# Altium schematic sheet [CC2538] Power Circuit.SchDoc
size 254 x 208 mm
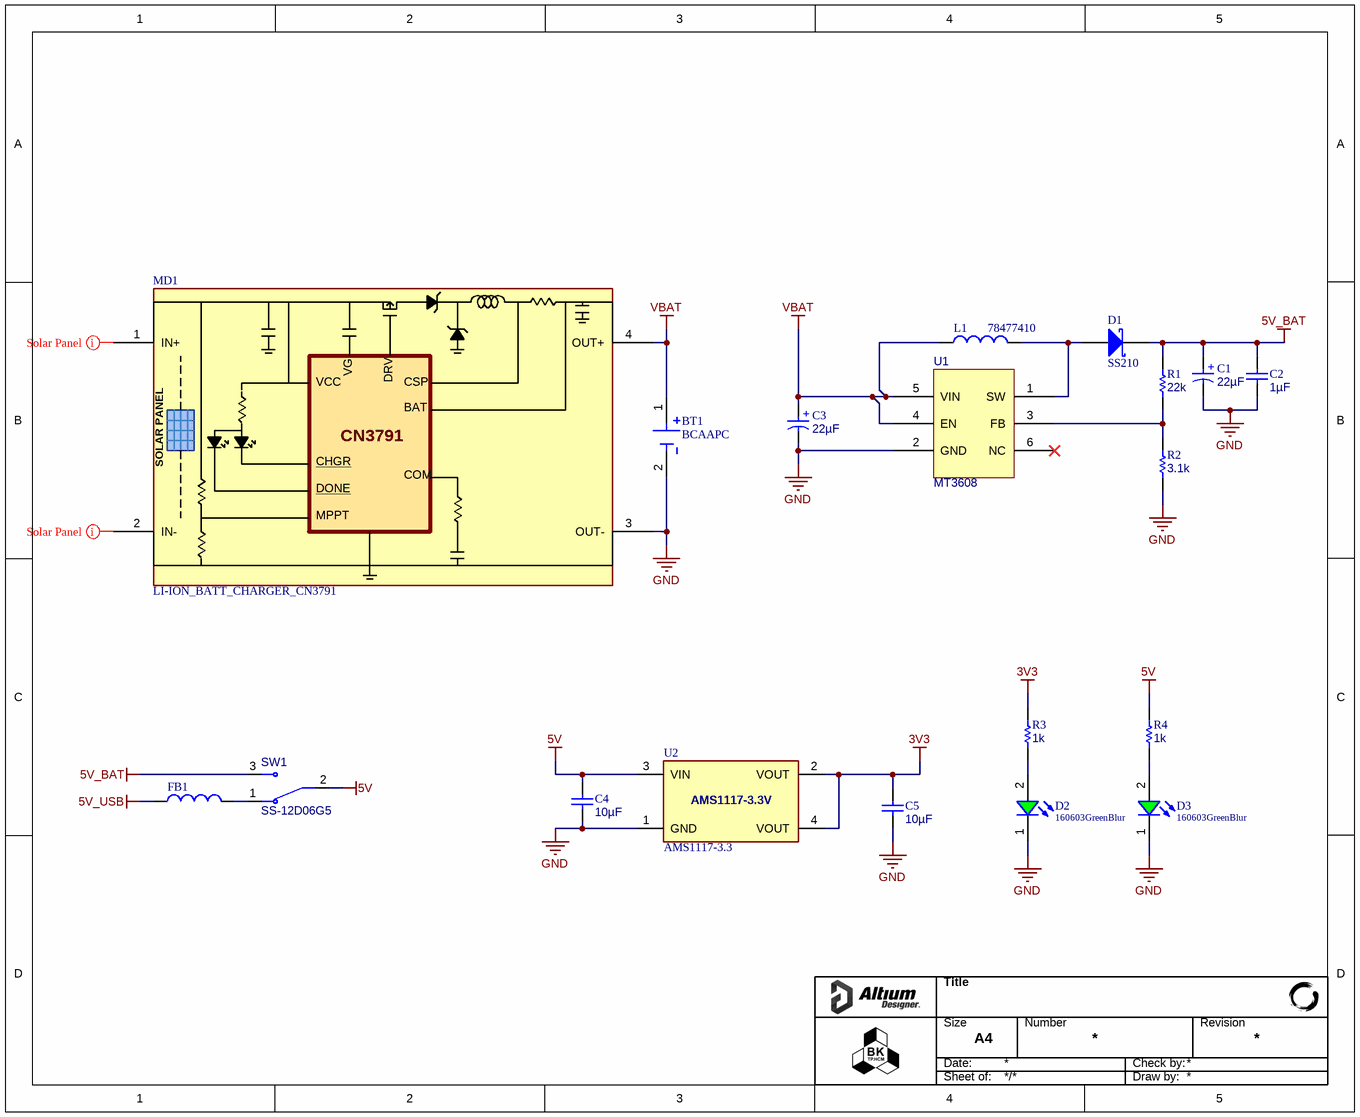
[diagram p0: [CC2538] Power Circuit.SchDoc]

## Parts
BT1  BCAAPC  [BCAAC]
C1  value 22µF  [WCAP-ASLI_D4H5.5]  (hidden comment: 865080340003)
C2  value 1µF  [CAP_0603]  (hidden comment: 0106031051016)
C3  value 22µF  [WCAP-ASLI_D4H5.5]  (hidden comment: 865080340003)
C4  value 10µF  [CAP_0603]  (hidden comment: 0106031061010)
C5  value 10µF  [CAP_0603]  (hidden comment: 0106031061010)
D1  SS210  [SS210-Footprint-SMA]
D2  160603GreenBlur  [WL-SMCW_0603_H=0.7mm]
D3  160603GreenBlur  [WL-SMCW_0603_H=0.7mm]
FB1  CBG160808U601T  [CBG160808U601T-Footprint]  (value not drawn)
L1  78477410  [WE-PD2A_4D28 (4730)]
MD1  LI-ION_BATT_CHARGER_CN3791  [LI-ION_BATT_CHARGER_CN3791-Footprint-1]
R1  value 22k  [RES_0603]  (hidden comment: 0006032231)
R2  value 3.1k  [RES_0603]  (hidden comment: 0006033121)
R3  value 1k  [RES_0603]  (hidden comment: 0006031021)
R4  value 1k  [RES_0603]  (hidden comment: 0006031021)
SW1  SS-12D06G5  [SS-12D06G5-Footprint]
U1  MT3608  [SOT95P280X145-6N]
U2  AMS1117-3.3  [FP-AMS1117-IPC_B]

## Nets
3V3: C5.2 R3.2 U2.2(VOUT) U2.4(VOUT)
5V: C4.2 R4.2 SW1.2 U2.3(VIN)
5V_BAT: C1.1(P) C2.2 D1.2(K) R1.2 SW1.3
5V_USB: FB1.1
GND: BT1.2(NEG) C1.2(N) C2.1 C3.2(N) C4.1 C5.1 D2.1(K) D3.1(K) MD1.3(OUT-) R2.1 U1.2(GND) U2.1(GND)
VBAT: BT1.1(POS) C3.1(P) L1.1 MD1.4(OUT+) U1.4(EN) U1.5(VIN)
NetD1_1: D1.1(A) L1.2 U1.1(SW)
NetD2_2: D2.2(A) R3.1
NetD3_2: D3.2(A) R4.1
NetFB1_2: FB1.2 SW1.1
NetR1_1: R1.1 R2.2 U1.3(FB)

Not connected (* = marked no-connect by the designer): MD1 1(IN+) 2(IN-); U1 6(NC)*

## Layout directives
mark named Solar Panel: NetMD1_1, NetMD1_2

## Notes on the sheet
- Inductor Selection
  The  recommended  values  of  inductor  are 4.7 to 22μH. Small size and better efficiency are the major concerns for portable device, such as MT3608 used for mobile phone. The inductor should have low core loss at 1.2MHz and low DCR for better efficiency. To avoid  inductor  saturation  current  rating  should  be  considered
- Diode Selection
  Schottky diode   is   a   good   choice   for   MT3608because  of  its  low  forward  voltage  drop  and  fast  reverses  recovery.  Using  Schottky  diode  can  get  better efficiency. The high speed rectification is also a  good  characteristic  of  Schottky  diode  for  high  switching frequency.
- (near U1) Capacitor Selection
  Input  and  output  ceramic  capacitors  of  22μF are recommended  for  MT3608  applications.
  The diode’ s reverse breakdown voltage should be larger than the output voltage
- (near R2) Output Voltage
  The  internal  reference VREF  is 0.6V (Typical).The output voltage is divided by a resistor divider,R1 and R2 to the FB pin. The output voltage is given by:
  VOUT=VREF(1+ROUT/RGND)
  Output Voltage: 5V
  VREF: 0.6V
- Title
- Size
- Date:
- A4
- Number
- Check by:
- Revision
- Sheet of:
- Draw by:
- (in symbol CMP-001-00129-2) +
- (in symbol CMP-019-00052-6) AMS1117-3.3V
- (in symbol CMP-00029-00007-6) VG; DRV; VCC; CSP; BAT; CN3791; SOLAR PANEL; CHGR; COM; DONE; MPPT

## Library data of the parts
BT1 = CMP-00029-00002-3: Battery Holder (Open) AA 1 Cell PC Pin; Supplier Locally Name: Thegioiic; Supplier Locally URL: https://www.thegioiic.com/hop-pin-1xaa-xuyen-lo-han-pcb
C1 C3 = CMP-001-00129-2: V-Chip, D4 x H5.5mm, 22uF, 16V; Manufacturer: Wurth Elektronik; Leakage Current: 3.52uA; Endurance: 2000h; Dissipation Factor: 16%; Capacitance Tolerance: +/-20%; Ripple Current: 90mA; Source: Al_Cap.SchLib; Supplier 1 URL: https://www.mouser.com/ProductDetail/Wurth-Elektronik/865080340003?qs=0KOYDY2FL2%252BowmC4S50IuQ%3D%3D; Supplier 2 URL: N/A; Supplier 3 SN: N/A; Pins: 2; Packaging: Tape and Reel; Manufacturer Part Number: N/A; Supplier 1 Name: Mouser; Operating Temperature Max: 105°C; Supplier 2 Name: Digi-Key; Supplier 2 SN: N/A; Design Item ID: 865080340003; Height: 5.5mm; Operating Temperature Min: -55°C; Component Type: Standard; Supplier 3 Name: thegioiic; Supplier 3 URL: https://www.thegioiic.com/tu-nhom-smd-22uf-16v-4x5-4mm; Category: Aluminum Electrolytic Capacitors; Rated Voltage (DC): 16V; Diameter: 4mm; Mount: Surface Mount; Supplier 1 SN: 710-865080340003
C2 = CMP-001-00177-2: CAP, size 0603, 1 uF, 16 VDC, 10%; Manufacturer Part Number: CL10B105KO8NNWC; Manufacturer: Samsung Electro-Mechanics; Voltage Rating DC: 16 VDC; Component Type: Standard; Supplier 3 URL: https://www.thegioiic.com/tu-gom-0603-1uf-16v; Operating Temperature Max: + 85 C; Tolerance: 10%; Supplier 3 Part Number: N/A; Source: Capacitor_0603_10_percent.SchLib; Case/Package: 0603; Supplier 1 Part Number: 187-CL10B105KO8NNWC; Operating Temperature Min: - 40 C; Packaging: Tape and Reel; Design Item ID: 0106031051016; LCSC Part #: C1592; Supplier 2 Part Number: 1276-CL10B105KO8NNWCTR-ND; Supplier 2 URL: https://www.digikey.com/en/products/detail/samsung-electro-mechanics/cl10b105ko8nnwc/16572783; Supplier 1 URL: https://www.mouser.vn/ProductDetail/Samsung-Electro-Mechanics/CL10B105KO8NNWC?qs=81r%252BiQLm7BT%252BXtc72qn1ug%3D%3D&utm_source=mouser-refine-download&utm_medium=file&utm_campaign=CL10B105KO8NNWC&utm_content=Samsung-Electro-Mechanics; ComponentLink1URL: https://www.mouser.vn/datasheet/2/585/Samsung_MLCC_1837944-1929650.pdf; Pins: 2; Mount: SMD/SMT; ComponentLink1Description: Datasheet
C4 C5 = CMP-001-00181-2: CAP, size 0603, 10 uF, 10 VDC, 10%; Manufacturer: Samsung Electro-Mechanics; Manufacturer Part Number: CL10A106KP8NNNC; Voltage Rating DC: 10 VDC; Supplier 2 Part Number: 1276-1192-2-ND; Pins: 2; Design Item ID: 0106031061010; Supplier 2 URL: https://www.digikey.com/en/products/detail/samsung-electro-mechanics/cl10a106kp8nnnc/3886850; Source: Capacitor_0603_10_percent.SchLib; Component Type: Standard; Operating Temperature Min: - 40 C; Packaging: Tape and Reel; Supplier 3 Part Number: N/A; Supplier 1 URL: https://www.mouser.vn/ProductDetail/Samsung-Electro-Mechanics/CL10A106KP8NNNC?qs=X6jEic%2FHinAlyfRHj7fKwg%3D%3D; LCSC Part #: C19702; Supplier 3 URL: https://www.thegioiic.com/tu-gom-0603-10uf-25v; ComponentLink1Description: Datasheet; Operating Temperature Max: + 85 C; ComponentLink1URL: https://www.mouser.vn/datasheet/2/585/MLCC-1837944.pdf; Mount: SMD/SMT; Case/Package: 0603; Supplier 1 Part Number: 187-CL10A106KP8NNNC; Tolerance: 10%
D1 = CMP-004-00056-1: Rectifier Diode, Schottky, 1 Phase, 1 Element, 1.5A, 100V V(RRM), Silicon, DO-214AA; Forward Voltage: 430mV; Max Operating Temperature: 150°C; Min Operating Temperature: -55°C; RoHS Compliant: Yes; Pins: 2
D2 D3 = CMP-004-00033-2: WL-SMCW SMT Mono-color Chip LED Blur, size 0603, Green, 3.2V, 140deg; ComponentLink1URL: N/A; ComponentLink4Description: Supplier 3 URL; Value: Green, 3.2V; ComponentLink2Description: Supplier 1 URL; Supplier 1 Name: Mouser; Supplier 1 SN: 755-SMLD12EN1WT86; Supplier 3 URL: N/A; Design Item ID: 160603GreenBlur; Supplier 3 Name: ICDayRoi; ComponentLink4URL: N/A; Color: Green; Pins: 2; Supplier 1 URL: https://www.mouser.vn/ProductDetail/ROHM-Semiconductor/SMLD12EN1WT86?qs=qSfuJ%252Bfl%2Fd4fR%252B9yZydIwg%3D%3D; Size: 0603; ComponentLink3Description: Supplier 2 URL; Type: Blur; Supplier 2 Name: Digi-Key; Supplier 2 SN: 511-1578-2-ND; Component Type: Standard; ComponentLink3URL: https://www.digikey.com/en/products/detail/rohm-semiconductor/SML-D12M8WT86/1641797; ComponentLink2URL: https://www.mouser.vn/ProductDetail/ROHM-Semiconductor/SMLD12EN1WT86?qs=qSfuJ%252Bfl%2Fd4fR%252B9yZydIwg%3D%3D; Source: WL-SMCW_0603.SchLib; Supplier 3 SN: N/A; Supplier 2 URL: https://www.digikey.com/en/products/detail/rohm-semiconductor/SML-D12M8WT86/1641797; ComponentLink1Description: Datasheet link
FB1 = CMP-006-00022-1: 0603 600Ω ±25% DCR=0.5Ω 0.2A
L1 = CMP-006-00021-3: General Purpose Inductor; RoHS Compliant: Yes
MD1 = CMP-00029-00007-6: CN3791 MPPT solar charge controller module uses the CN3791 IC which’s a pulse width modulated switch-mode lithium-ion battery charge controller that can be powered by a photovoltaic cell with maximum power point tracking function
R1 = CMP-009-00278-4: RES, size 0603, 22 KOhm, 1/10 W, 1%; Manufacturer: OEM; Rated Power: 1/10 W; Design Item ID: 0006032231; Mount: SMD/SMT; LCSC Part #: N/A; Supplier 1 Part Number: 667-ERJ-UP3F2202V; Supplier 3 URL: N/A; Operating Temperature Max: + 85 C; Tolerance: 1%; Component Type: Standard; Pins: 2; Source: Resistor_0603.SchLib; ComponentLink1URL: https://api.pim.na.industrial.panasonic.com/file_stream/main/fileversion/4484; Operating Temperature Min: - 40 C; Manufacturer Part Number: OEM; Supplier 2 URL: https://www.digikey.com/en/products/detail/panasonic-electronic-components/ERJ-UP3F2202V/12092693; Supplier 2 Part Number: 10-ERJ-UP3F2202VTR-ND 10-ERJ-UP3F2202VCT-ND 10-ERJ-UP3F2202VDKR-ND; Supplier 1 URL: https://www.mouser.vn/ProductDetail/Panasonic/ERJ-UP3F2202V?qs=sGAEpiMZZMvdGkrng054twq3eZrCFN893x5tBCka%252B6wRswHHN2WaIQ%3D%3D; Packaging: Tape and Reel; Case/Package: 0603; ComponentLink1Description: Datasheet; Supplier 3 Part Number: N/A
R2 = CMP-009-00309-4: RES, size 0603, 3.1  KOhm, 1/10 W, 1%; Manufacturer Part Number: OEM; Rated Power: 1/10 W; LCSC Part #: N/A; Mount: SMD/SMT; Supplier 2 URL: https://www.digikey.com/en/products/detail/vishay-beyschlag-draloric-bc-components/MCT06030C3101FP500/8124767; Supplier 1 URL: https://www.mouser.vn/ProductDetail/Bourns/CHP0603-FX-3011ELF?qs=gZXFycFWdAOzN1n7XWkwdg%3D%3D; Case/Package: 0603; ComponentLink1Description: Datasheet; ComponentLink1URL: N/A; Tolerance: 1%; Supplier 3 Part Number: N/A; Supplier 3 URL: N/A; Supplier 2 Part Number: MCT06030C3101FP500-ND; Design Item ID: 0006033121; Operating Temperature Max: + 85 C; Packaging: Tape and Reel; Operating Temperature Min: - 40 C; Source: Resistor_0603.SchLib; Component Type: Standard; Supplier 1 Part Number: 652-CHP0603FX3011ELF; Manufacturer: OEM; Pins: 2
R3 R4 = CMP-009-00185-4: RES, size 0603, 1 KOhm, 1/10 W, 1%; Manufacturer Part Number: RC0603FR-071KL; Manufacturer: YAGEO; Rated Power: 1/10 W; Tolerance: 1%; Supplier 1 URL: https://www.mouser.vn/ProductDetail/YAGEO/RC0603FR-071KL?qs=VU8sRB4EgwApHsk4rF%2F3zg%3D%3D; ComponentLink1URL: https://www.yageo.com/upload/media/product/productsearch/datasheet/rchip/PYu-SR_20105_RoHS_L_10.pdf; Supplier 3 URL: N/A; Case/Package: 0603; Supplier 2 URL: https://www.digikey.com/en/products/detail/yageo/rc0603fr-071kl/726843; Mount: SMD/SMT; Supplier 2 Part Number: 311-1.00KHRTR-ND; Source: Resistor_0603.SchLib; Packaging: Tape and Reel; Component Type: Standard; Design Item ID: 0006031021; ComponentLink1Description: Datasheet; Operating Temperature Max: + 85 C; Supplier 3 Part Number: N/A; Operating Temperature Min: - 40 C; LCSC Part #: C22548; Supplier 1 Part Number: 603-RC0603FR-071KL; Pins: 2
SW1 = CMP-011-00018-1
U1 = CMP-019-00055-2: 1.2MHz 2A Vi=2V~24V Vo=28V(Max); Max Supply Voltage: 24V; Min Supply Voltage: 2V; Max Operating Temperature: 85°C; Locally Supplier Name: Thegioiic; Case/Package: SOT23-6; Mounting Technology: SMT; Frequency: 1.2MHz; Locally Supplier URL: https://www.thegioiic.com/mt3608-ic-dieu-chinh-tang-ap-2a-sot-23-6; Min Operating Temperature: -40°C
U2 = CMP-019-00052-6: Fixed Positive LDO Regulator, 3.3V, 1.3V Dropout, PDSO3; Min Supply Voltage: 4.8V; Output Current: 1A; Max Supply Voltage: 15V; Locally Supplier URL: https://www.thegioiic.com/ams1117-3-3v-ic-on-ap-3-3v-1a-sot-223; Output Voltage: 3.3V; Locally Supplier Name: Thegioiic; Min Operating Temperature: -40°C; Case/Package: SOT-223; RoHS Compliant: Yes; Pins: 3; Mounting Technology: SMT; Max Operating Temperature: 125°C; Dropout Voltage: 1.3V; Nominal Supply Current: 1A